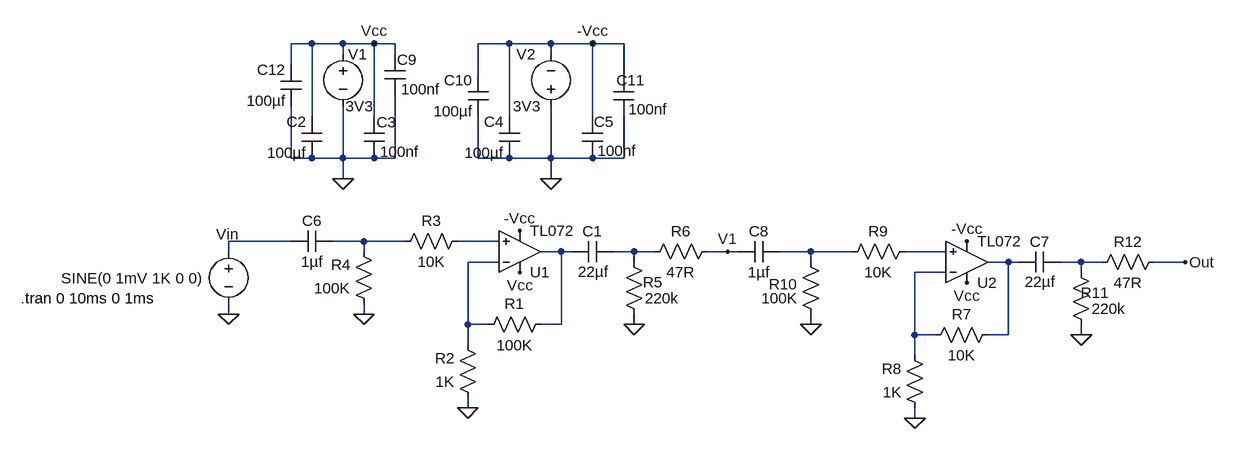
[diagram p0: schematic PreAmpli.asc]
PreAmpli.asc, the LTspice schematic file:
Version 4.1
SHEET 1 1372 680
WIRE -80 -192 -112 -192
WIRE -32 -192 -80 -192
WIRE 16 -192 -32 -192
WIRE 48 -192 16 -192
WIRE 224 -192 176 -192
WIRE 288 -192 224 -192
WIRE 352 -192 288 -192
WIRE 400 -192 352 -192
WIRE -32 -176 -32 -192
WIRE 48 -176 48 -192
WIRE 288 -176 288 -192
WIRE -112 -160 -112 -192
WIRE 176 -144 176 -192
WIRE 400 -144 400 -192
WIRE -80 -80 -80 -192
WIRE 16 -80 16 -192
WIRE 224 -80 224 -192
WIRE 352 -80 352 -192
WIRE -112 -16 -112 -96
WIRE -80 -16 -112 -16
WIRE -32 -16 -32 -96
WIRE -32 -16 -80 -16
WIRE 16 -16 -32 -16
WIRE 48 -16 48 -112
WIRE 48 -16 16 -16
WIRE 176 -16 176 -80
WIRE 224 -16 176 -16
WIRE 288 -16 288 -96
WIRE 288 -16 224 -16
WIRE 352 -16 288 -16
WIRE 400 -16 400 -80
WIRE 400 -16 352 -16
WIRE -32 16 -32 -16
WIRE 288 16 288 -16
WIRE -112 112 -208 112
WIRE 0 112 -48 112
WIRE 64 112 0 112
WIRE 208 112 144 112
WIRE -208 128 -208 112
WIRE 0 128 0 112
WIRE 304 128 272 128
WIRE 320 128 304 128
WIRE 416 128 384 128
WIRE 448 128 416 128
WIRE 560 128 528 128
WIRE 576 128 560 128
WIRE 688 128 640 128
WIRE 752 128 688 128
WIRE 896 128 832 128
WIRE 208 144 160 144
WIRE 416 144 416 128
WIRE 688 144 688 128
WIRE 992 144 960 144
WIRE 1008 144 992 144
WIRE 1104 144 1072 144
WIRE 1136 144 1104 144
WIRE 1264 144 1216 144
WIRE 896 160 848 160
WIRE 1104 160 1104 144
WIRE -208 224 -208 208
WIRE 0 224 0 208
WIRE 160 240 160 144
WIRE 192 240 160 240
WIRE 304 240 304 128
WIRE 304 240 272 240
WIRE 416 240 416 224
WIRE 688 240 688 224
WIRE 848 256 848 160
WIRE 880 256 848 256
WIRE 992 256 992 144
WIRE 992 256 960 256
WIRE 1104 256 1104 240
WIRE 160 272 160 240
WIRE 848 288 848 256
WIRE 160 368 160 352
WIRE 848 384 848 368
FLAG 160 368 0
FLAG 416 240 0
FLAG 0 224 0
FLAG -32 16 0
FLAG 288 16 0
FLAG -208 224 0
FLAG 16 -192 Vcc
FLAG 352 -192 -Vcc
FLAG 240 160 Vcc
FLAG 240 96 -Vcc
FLAG 848 384 0
FLAG 1104 256 0
FLAG 688 240 0
FLAG 928 176 Vcc
FLAG 928 112 -Vcc
FLAG 1264 144 Out
FLAG 560 128 V1
SYMBOL TL072 240 192 M180
SYMATTR InstName U1
SYMBOL res 288 224 R90
WINDOW 0 0 56 VBottom 2
WINDOW 3 32 56 VTop 2
SYMATTR InstName R1
SYMATTR Value 100K
SYMBOL res 176 368 R180
WINDOW 0 36 76 Left 2
WINDOW 3 36 40 Left 2
SYMATTR InstName R2
SYMATTR Value 1K
SYMBOL res 160 96 R90
WINDOW 0 0 56 VBottom 2
WINDOW 3 32 56 VTop 2
SYMATTR InstName R3
SYMATTR Value 10K
SYMBOL res 16 224 R180
WINDOW 0 36 76 Left 2
WINDOW 3 36 40 Left 2
SYMATTR InstName R4
SYMATTR Value 100K
SYMBOL res 432 240 R180
WINDOW 0 -28 65 Left 2
WINDOW 3 -53 40 Left 2
SYMATTR InstName R5
SYMATTR Value 220k
SYMBOL res 432 144 R270
WINDOW 0 32 56 VTop 2
WINDOW 3 0 56 VBottom 2
SYMATTR InstName R6
SYMATTR Value 47R
SYMBOL cap 384 112 R90
WINDOW 0 0 32 VBottom 2
WINDOW 3 31 31 VTop 2
SYMATTR InstName C1
SYMATTR Value 22µf
SYMBOL cap -64 -16 R180
WINDOW 0 24 56 Left 2
WINDOW 3 24 8 Left 2
SYMATTR InstName C2
SYMATTR Value 100µf
SYMBOL cap 32 -16 R180
WINDOW 0 -18 55 Left 2
WINDOW 3 -54 10 Left 2
SYMATTR InstName C3
SYMATTR Value 100nf
SYMBOL cap 240 -16 R180
WINDOW 0 24 56 Left 2
WINDOW 3 24 8 Left 2
SYMATTR InstName C4
SYMATTR Value 100µf
SYMBOL cap 368 -16 R180
WINDOW 0 -17 56 Left 2
WINDOW 3 -52 11 Left 2
SYMATTR InstName C5
SYMATTR Value 100nf
SYMBOL cap -112 128 R270
WINDOW 0 32 32 VTop 2
WINDOW 3 0 32 VBottom 2
SYMATTR InstName C6
SYMATTR Value 1µf
SYMBOL voltage -32 -192 R0
WINDOW 0 8 16 Left 2
WINDOW 3 4 96 Left 2
WINDOW 123 0 0 Left 0
WINDOW 39 0 0 Left 0
SYMATTR InstName V1
SYMATTR Value 3V3
SYMBOL voltage 288 -80 R180
WINDOW 0 24 96 Left 2
WINDOW 3 16 16 Left 2
WINDOW 123 0 0 Left 0
WINDOW 39 0 0 Left 0
SYMATTR InstName V2
SYMATTR Value 3V3
SYMBOL voltage -208 112 R0
WINDOW 0 -19 -11 Left 2
WINDOW 3 -258 57 Left 2
WINDOW 123 0 0 Left 0
WINDOW 39 0 0 Left 0
SYMATTR InstName Vin
SYMATTR Value SINE(0 1mV 1K 0 0)
SYMBOL TL072 928 208 M180
SYMATTR InstName U2
SYMBOL res 976 240 R90
WINDOW 0 0 56 VBottom 2
WINDOW 3 32 56 VTop 2
SYMATTR InstName R7
SYMATTR Value 10K
SYMBOL res 864 384 R180
WINDOW 0 36 76 Left 2
WINDOW 3 36 40 Left 2
SYMATTR InstName R8
SYMATTR Value 1K
SYMBOL res 848 112 R90
WINDOW 0 0 56 VBottom 2
WINDOW 3 32 56 VTop 2
SYMATTR InstName R9
SYMATTR Value 10K
SYMBOL res 704 240 R180
WINDOW 0 36 62 Left 2
WINDOW 3 36 40 Left 2
SYMATTR InstName R10
SYMATTR Value 100K
SYMBOL res 1120 256 R180
WINDOW 0 -28 65 Left 2
WINDOW 3 -53 40 Left 2
SYMATTR InstName R11
SYMATTR Value 220k
SYMBOL res 1120 160 R270
WINDOW 0 32 56 VTop 2
WINDOW 3 0 56 VBottom 2
SYMATTR InstName R12
SYMATTR Value 47R
SYMBOL cap 1072 128 R90
WINDOW 0 0 32 VBottom 2
WINDOW 3 31 31 VTop 2
SYMATTR InstName C7
SYMATTR Value 22µf
SYMBOL cap 576 144 R270
WINDOW 0 32 32 VTop 2
WINDOW 3 0 32 VBottom 2
SYMATTR InstName C8
SYMATTR Value 1µf
SYMBOL cap 192 -80 R180
WINDOW 0 24 56 Left 2
WINDOW 3 24 8 Left 2
SYMATTR InstName C10
SYMATTR Value 100µf
SYMBOL cap 416 -80 R180
WINDOW 0 -17 56 Left 2
WINDOW 3 -52 11 Left 2
SYMATTR InstName C11
SYMATTR Value 100nf
SYMBOL cap 64 -112 R180
WINDOW 0 -18 55 Left 2
WINDOW 3 -54 10 Left 2
SYMATTR InstName C9
SYMATTR Value 100nf
SYMBOL cap -96 -96 R180
WINDOW 0 24 56 Left 2
WINDOW 3 24 8 Left 2
SYMATTR InstName C12
SYMATTR Value 100µf
TEXT -528 200 Left 2 !.tran 0 10ms 0 1ms

The netlist it stands for:
* PreAmpli.asc
* U1: TL072 (symbol TL072 not available, pins judged from their places): In+=N003 In-=N008 V+=Vcc V-=-Vcc OUT=N004
R1 N004 N008 100K
R2 0 N008 1K
R3 N003 N002 10K
R4 0 N002 100K
R5 0 N005 220k
R6 N005 V1 47R
C1 N005 N004 22µf
C2 0 Vcc 100µf
C3 0 Vcc 100nf
C4 0 -Vcc 100µf
C5 0 -Vcc 100nf
C6 N001 N002 1µf
V1 Vcc 0 3V3
V2 0 -Vcc 3V3
Vin N001 0 SINE(0 1mV 1K 0 0)
* U2: TL072 (symbol TL072 not available, pins judged from their places): In+=N007 In-=N011 V+=Vcc V-=-Vcc OUT=N009
R7 N009 N011 10K
R8 0 N011 1K
R9 N007 N006 10K
R10 0 N006 100K
R11 0 N010 220k
R12 N010 Out 47R
C7 N010 N009 22µf
C8 V1 N006 1µf
C10 0 -Vcc 100µf
C11 0 -Vcc 100nf
C9 0 Vcc 100nf
C12 0 Vcc 100µf
.tran 0 10ms 0 1ms
.backanno
.end